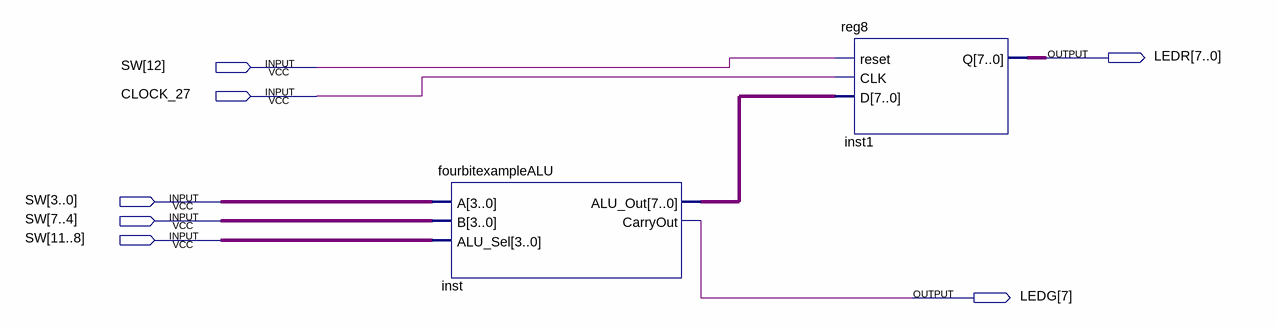
[diagram p0: schematic sheet]
// Quartus schematic TESTDELETELATER.bdf as structural Verilog: 2 symbols, 7 pins
module TESTDELETELATER (
  input  [12:0] SW,
  input  CLOCK_27,
  output [7:0] LEDR,
  output [7:7] LEDG
);

  wire [7:0] inst_alu_out;

  fourbitexampleALU inst (.A(SW[3:0]), .B(SW[7:4]), .ALU_Sel(SW[11:8]), .ALU_Out(inst_alu_out), .CarryOut(LEDG[7]));
  reg8 inst1 (.reset(SW[12]), .CLK(CLOCK_27), .D(inst_alu_out), .Q(LEDR));
endmodule
